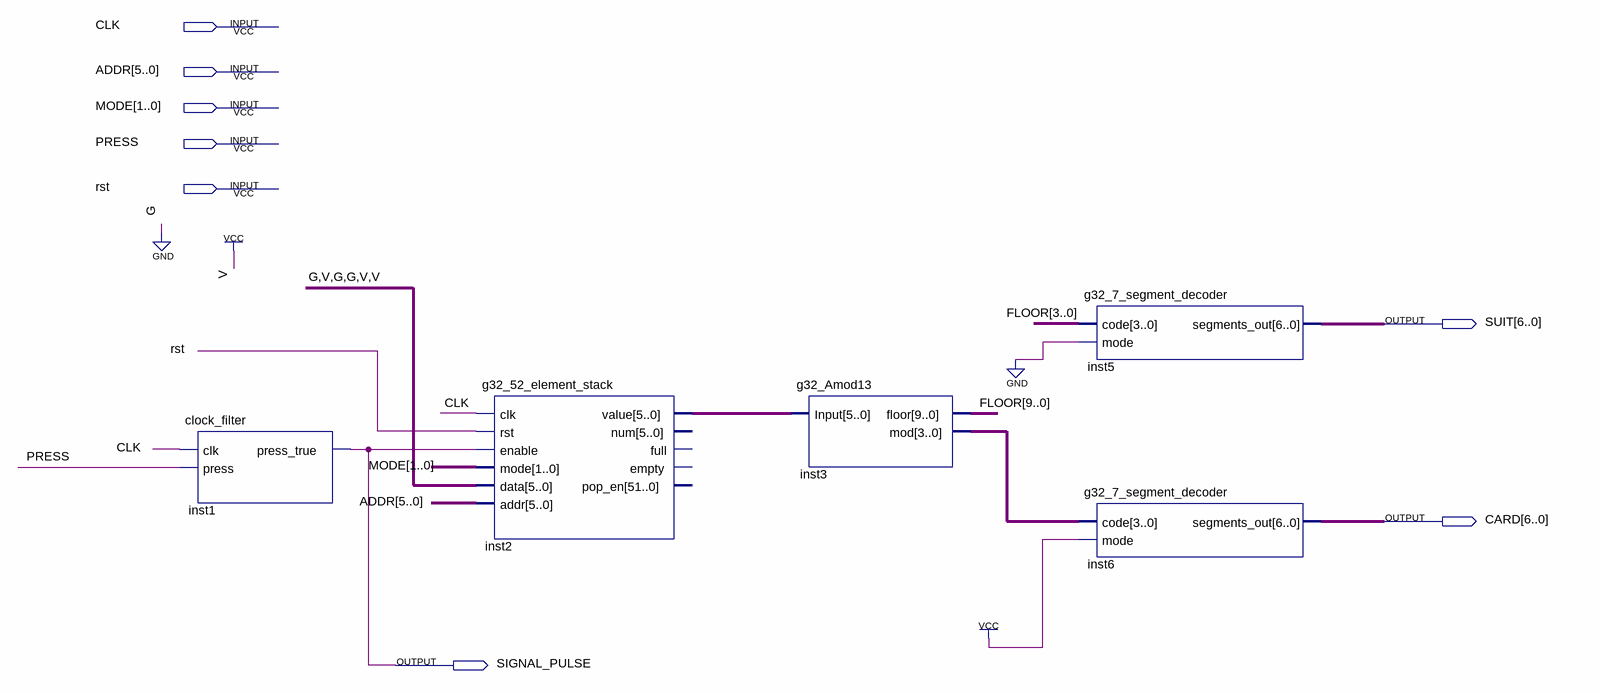
[diagram p0: schematic sheet]
// Quartus schematic testbed.bdf as structural Verilog: 5 symbols, 8 pins
module testbed (
  input  CLK,
  input  [5:0] ADDR,
  input  [1:0] MODE,
  input  PRESS,
  input  rst,
  output [6:0] SUIT,
  output [6:0] CARD,
  output SIGNAL_PULSE
);

  wire [3:0] inst3_mod;
  wire [5:0] inst2_value;
  wire [9:0] FLOOR;

  clock_filter inst1 (.clk(CLK), .press(PRESS), .press_true(SIGNAL_PULSE));
  g32_52_element_stack inst2 (
    .clk(CLK), .rst(rst), .enable(SIGNAL_PULSE), .mode(MODE), .data(6'b010011), .addr(ADDR),
    .value(inst2_value));  // open: num, full, empty, pop_en
  g32_Amod13 inst3 (.Input(inst2_value), .floor(FLOOR), .mod(inst3_mod));
  g32_7_segment_decoder inst5 (.code(FLOOR[3:0]), .mode(1'b0), .segments_out(SUIT));
  g32_7_segment_decoder inst6 (.code(inst3_mod), .mode(1'b1), .segments_out(CARD));
endmodule
